# EAGLE design Z05_CC_SHIELD_02 (EAGLE 6.5.0)
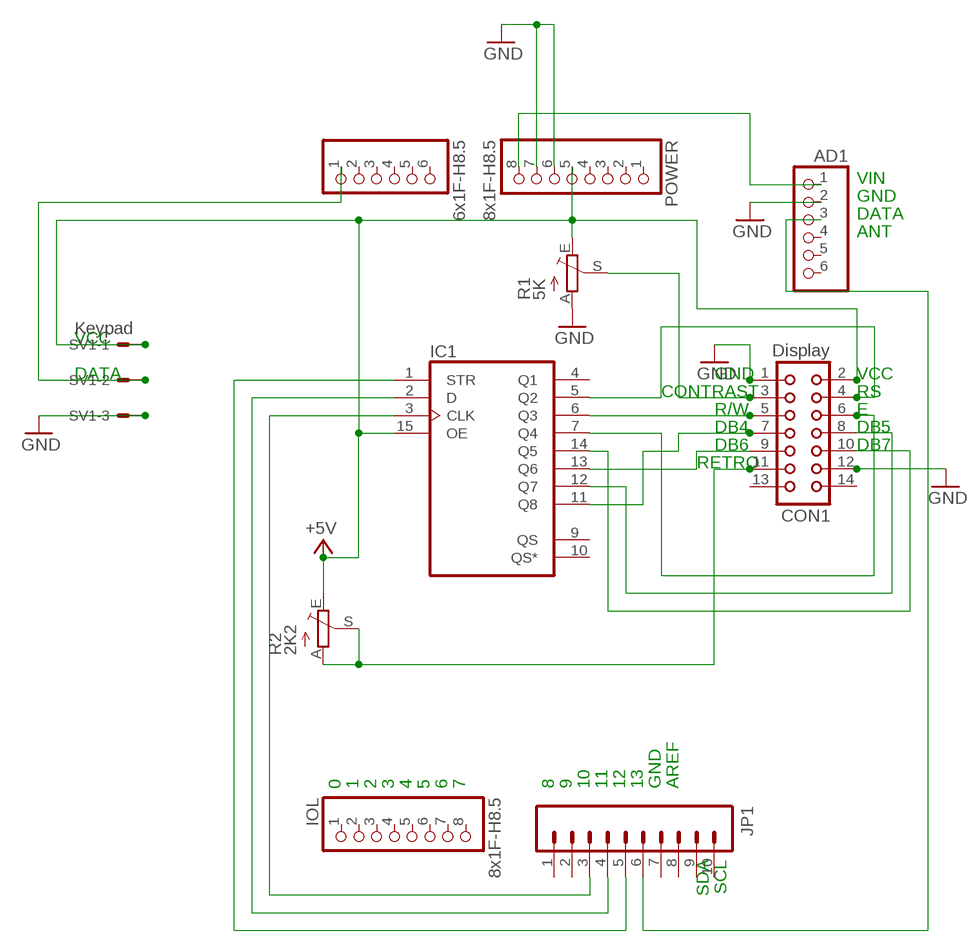
[diagram p0: schematic, sheet 1]

## Parts
AD  6x1F-H8.5  PINHD-1X6  [1X06]
AD1  6x1F-H8.5  PINHD-1X6  [1X06]
CON1  Display  CON14  [CON14]
IC1  4094N  [DIL16]
IOL  8x1F-H8.5  PINHD-1X8  [1X08]
JP1  M10"  [1X10]
POWER  8x1F-H8.5  PINHD-1X8  [1X08]
R1  5K  TRIM_EU-LI10  [LI10]
R2  2K2  TRIM_EU-LI10  [LI10]
SV1  Keypad  22-05-7058-05  [7395-05]

## Nets
+5V [usbvcc]: CON1.2 IC1.15(OE) POWER.5 R1.E R2.E SV1.1
A5: AD.1 SV1.2
GND [gnd]: AD1.2 CON1.1 CON1.12 POWER.6 POWER.7 R1.A SV1.3
N$1: CON1.11 R2.A R2.S
N$3: AD1.3 JP1.6
N$4: CON1.3 R1.S
N$5: IC1.1(STR) JP1.5
N$6: IC1.2(D) JP1.4
N$7: IC1.3(CLK) JP1.3
N$8: CON1.4 IC1.5(Q2)
N$9: CON1.5 IC1.6(Q3)
N$10: CON1.6 IC1.7(Q4)
N$11: CON1.7 IC1.11(Q8)
N$12: CON1.8 IC1.12(Q7)
N$13: CON1.9 IC1.13(Q6)
N$14: CON1.10 IC1.14(Q5)
VIN: AD1.1 POWER.8
Unconnected: AD1.4 AD1.5 AD1.6 AD.2 AD.3 AD.4 AD.5 AD.6 CON1.13 CON1.14 IC1.4(Q1) IC1.9(QS) IC1.10(QS*) IOL.1 IOL.2 IOL.3 IOL.4 IOL.5 IOL.6 IOL.7 IOL.8 JP1.1 JP1.2 JP1.7 JP1.8 JP1.9 JP1.10 POWER.1 POWER.2 POWER.3 POWER.4 SV1.4 SV1.5

## Notes on the sheet
- VIN
- GND
- DATA
- ANT
- VCC
- DATA | GND | VCC
- CONTRAST | RS
- R/W | E
- DB4 | DB5
- DB6 | DB7
- RETRO
- 0 | 1 | 2 | 3 | 4 | 5 | 6 | 7 | 8 | 9 | 10 | 11 | 12 | 13 | GND | AREF
- SDA | SCL

## Power pins joined to a net without a drawn wire
VDD: IC1.16(VDD)
VSS: IC1.8(VSS)

## Library data of the parts
AD AD1 = SmartPrj:PINHD-1X6: PIN HEADER
CON1 = con-harting:CON14: CONNECTOR; OC_FARNELL: unknown; OC_NEWARK: unknown
IC1 = 40xx:4094: 8-stage SHIFT/STORE REGISTER, tri-state
IOL POWER = SmartPrj:PINHD-1X8: PIN HEADER
JP1 = SparkFun-Connectors:M10: Header 10 Standard 10-pin 0.1" header. Use with straight break away headers (SKU : PRT-00116), right angle break away headers (PRT-00553), swiss pins (PRT-00743), machine pins (PRT-00117), and female headers (PRT-00115).
R1 R2 = pot:TRIM_EU-: POTENTIOMETER
SV1 = con-molex:22-?-05: CONNECTOR wire to board 2.54 mm (.1 inch) pitch header; OC_FARNELL: unknown; OC_NEWARK: unknown

## Net classes
0 default: width 0.254 mm, clearance 0.254 mm
1 power: width 0.61 mm, drill 0.61 mm, clearance 0.254 mm
2 gnd: width 0.305 mm, drill 0.559 mm, clearance 0.254 mm
3 usbvcc: width 0.406 mm, drill 0.508 mm, clearance 0.254 mm
4 aref: width 0.406 mm, drill 0.61 mm, clearance 0.254 mm

## Board
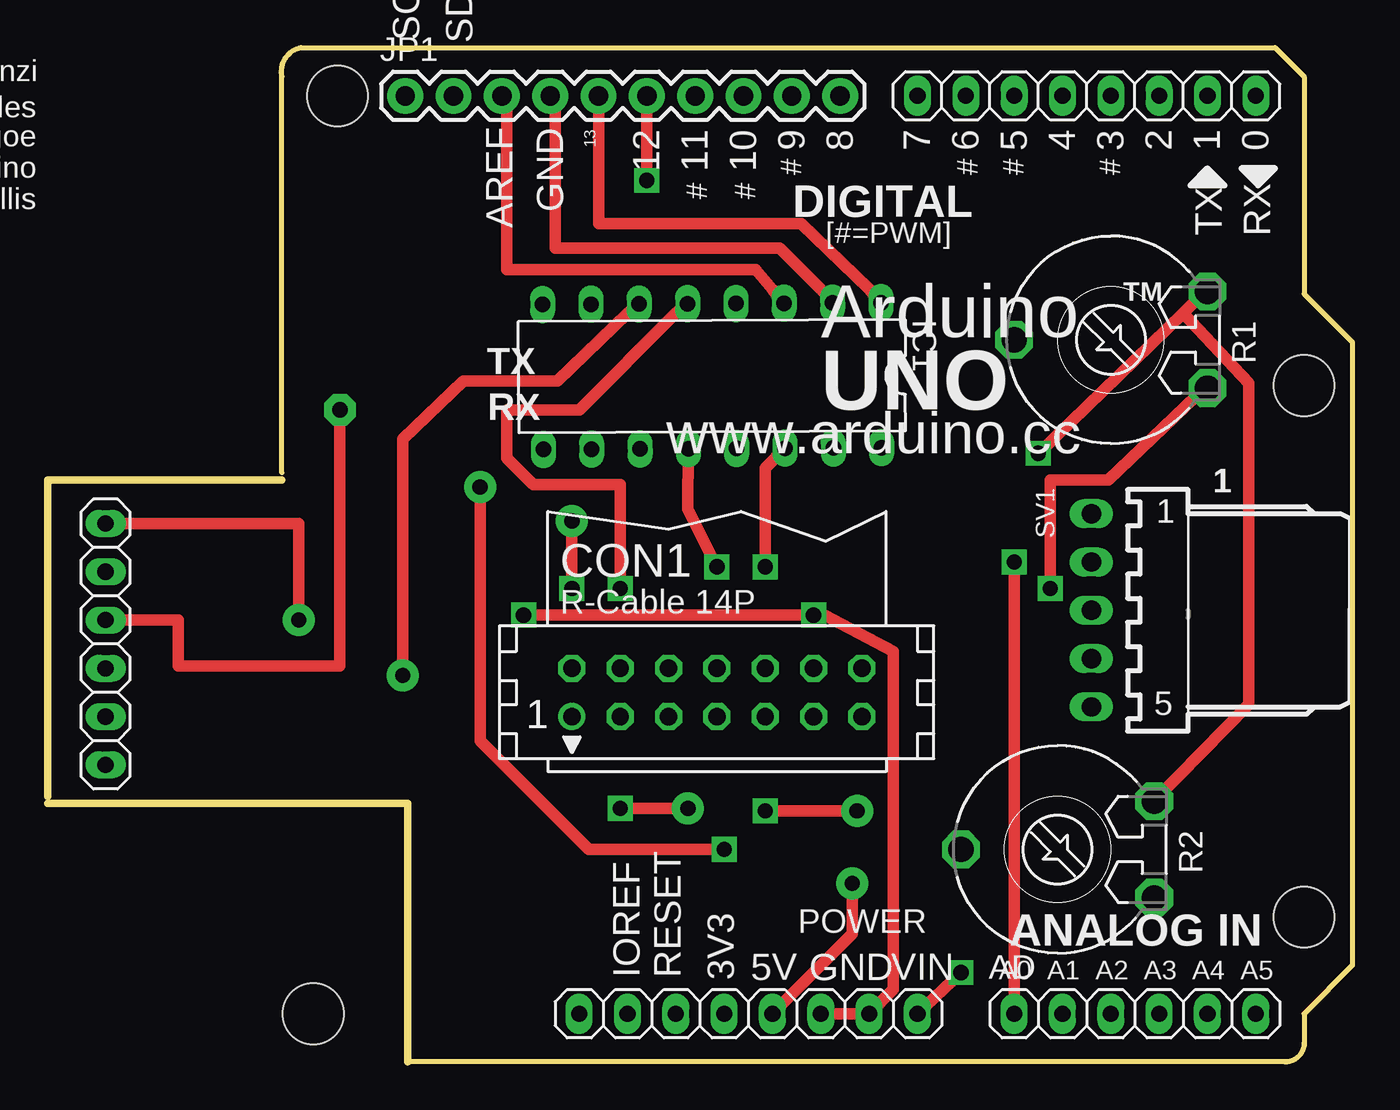
[diagram p1: board, top side]
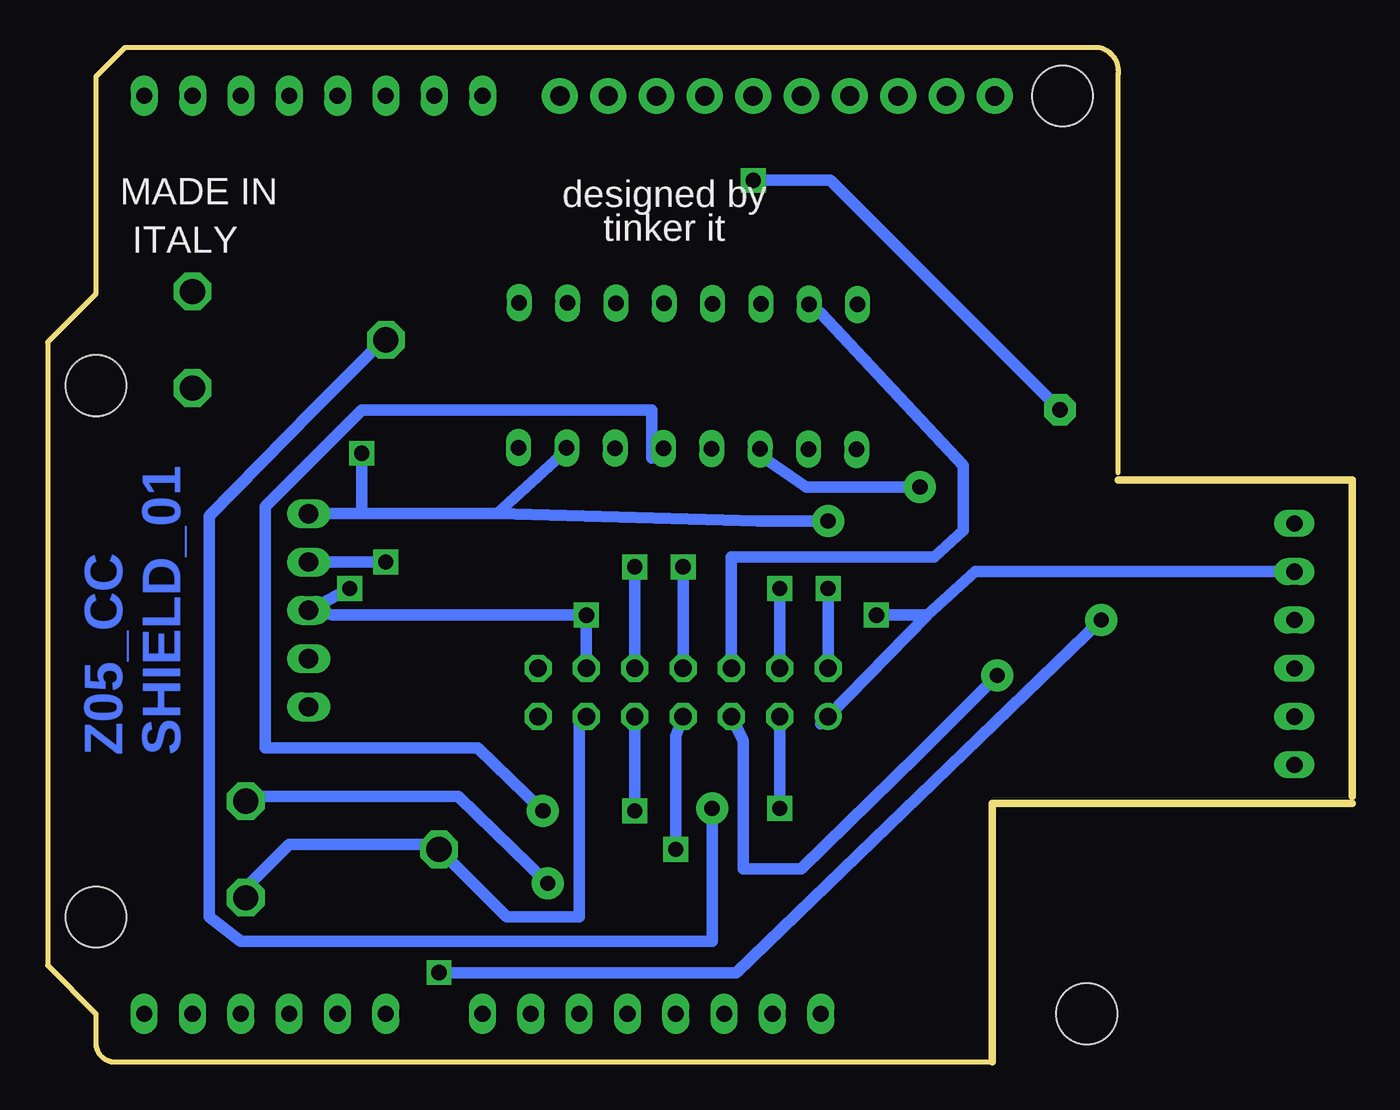
[diagram p2: board, bottom side, seen from below]

Size 68.58 x 53.34 mm. Coordinates in mm from the lower left corner, seen from the top.
Outline: 12.32,30.97 12.32,51.83 arc-90 13.32,53.34 64.52,53.34 66.04,51.82 66.04,40.39 68.58,37.85 68.58,5.08 66.04,2.54 66.04,1 arc-90 65.04,0 18.92,0 18.92,13.59 0,13.59
Outline: 12.32,30.61 0,30.61 0,13.97
Copper layers (1*16): Top 0.035mm / dielectric 1.5mm / Bottom 0.035mm
Design rules "default *": minimum track width 16mil, minimum drill 20mil, track to track 16mil, track to pad 12mil, pad to pad 12mil, via to via 12mil, smd to smd 8mil, copper to edge 26mil, drill to drill 12mil, minimum pad ring 10mil, minimum via ring 10mil, stop-mask expansion 1mil, vias tented up to drill 30mil, thermal gap 10mil
Holes 3.2 mm at 66.04,35.56 66.04,7.62 15.24,50.8 13.97,2.54
vRestrict: area 22.9,44.1 to 24.6,49.1; area 25.4,45.5 to 27.1,49.1; area 28.4,45.3 to 29.6,48.8; area 31,45.3 to 32.1,48.8; area 33.5,45.3 to 34.7,48.8; area 36.1,45.3 to 37.2,48.8; area 38.7,47.2 to 39.9,48.8; area 40.3,45.1 to 47.6,46.9; area 60.3,44.2 to 61.7,46.7; area 62.9,44.2 to 64.3,46.7; area 61.3,35.8 to 64.8,37.2; area 0.6,21.8 to 2,30.1; 14 more areas

### Footprints (pad centres in the part's own frame; a part is rotated, then mirrored left to right if it is on the bottom)
1X06 = drill 0.85 pad 1.422 long: 1 -6.35,0; 2 -3.81,0; 3 -1.27,0; 4 1.27,0; 5 3.81,0; 6 6.35,0
CON14 = drill 0.914: 1 -7.62,-1.27 | drill 0.914 octagon: 2 -7.62,1.27; 3 -5.08,-1.27; 4 -5.08,1.27; 5 -2.54,-1.27; 6 -2.54,1.27; 7 0,-1.27; 8 0,1.27; 9 2.54,-1.27; 10 2.54,1.27; 11 5.08,-1.27; 12 5.08,1.27; 13 7.62,-1.27; 14 7.62,1.27
DIL16 = drill 0.813 long: 1 -8.89,-3.81; 2 -6.35,-3.81; 3 -3.81,-3.81; 4 -1.27,-3.81; 5 1.27,-3.81; 6 3.81,-3.81; 7 6.35,-3.81; 8 8.89,-3.81; 9 8.89,3.81; 10 6.35,3.81; 11 3.81,3.81; 12 1.27,3.81; 13 -1.27,3.81; 14 -3.81,3.81; 15 -6.35,3.81; 16 -8.89,3.81
1X08 = drill 0.85 pad 1.422 long: 1 -8.89,0; 2 -6.35,0; 3 -3.81,0; 4 -1.27,0; 5 1.27,0; 6 3.81,0; 7 6.35,0; 8 8.89,0
1X10 = drill 1.016 pad 1.88: 1 0,0; 2 2.54,0; 3 5.08,0; 4 7.62,0; 5 10.16,0; 6 12.7,0; 7 15.24,0; 8 17.78,0; 9 20.32,0; 10 22.86,0
LI10 = drill 1.321 octagon: A -2.54,-5.08; E 2.54,-5.08; S 0,5.08
7395-05 = drill 1.016 long: 1 5.08,0; 2 2.54,0; 3 0,0; 4 -2.54,0; 5 -5.08,0

### Placement (x,y rotation side)
AD  57.15,2.54 0 top
AD1  3.05,21.97 270 top
CON1  35.18,19.43 0 top
IC1  34.92,36.07 180.3 top
IOL  54.61,50.8 180 top
JP1  18.8,50.8 0 top
POWER  36.83,2.54 0 top
R1  55.88,37.97 90 top
R2  53.09,11.18 90 top
SV1  54.86,23.75 90 top

### Tracks (layer width: path | path; a pad name or v marks a point on that pad's centre or on a via)
+5V  (via drill 0.8, 0.8 pad 1.68)
  Top 0.61: POWER.5 42.29,6.73 v42.29,9.4 | v27.56,28.45 v27.56,24.89 | v52.07,32 59.69,39.37 | 59.69,39.37 60.96,40.64 R1.E | R2.E 63.12,18.8 63.12,35.69 59.69,39.37
  Bottom 0.508: 58.42,13.97 R2.E
  Bottom 0.61: v42.29,9.4 46.99,13.97 58.42,13.97 | 44.96,28.83 41.91,31.62 IC1.15 | 44.96,28.83 52.07,28.83 | 52.07,28.83 SV1.1 | v27.56,24.89 CON1.2 | v27.56,28.45 31.24,28.45 44.96,28.83 | 52.07,28.83 v52.07,32
A5  (via drill 0.8)
  Top 0.61: v50.8,26.29 AD.1
  Bottom 0.61: SV1.2 v50.8,26.29
GND  (via drill 0.8)
  Top 0.406: 60.96,35.56 R1.A
  Top 0.61: POWER.6 POWER.7 44.45,3.81 44.45,21.59 40.39,23.75 v40.26,23.5 v25.02,23.5 | 60.96,35.56 55.75,30.61 52.7,30.61 v52.7,24.89
  Bottom 0.61: AD1.2 19.81,25.78 22.35,23.5 | 22.35,23.5 CON1.1 27.94,17.78 | CON1.12 v40.26,23.5 53.59,23.5 SV1.3 v52.7,24.89 | v25.02,23.5 22.35,23.5
N$1
  Bottom 0.406: 48.26,11.43 R2.S
  Bottom 0.61: R2.S 44.45,7.62 40.64,7.62 40.64,17.78 CON1.11 | 48.26,11.43 55.88,11.43 58.42,8.89 R2.A
N$3  (via drill 0.8, 0.8 pad 1.68)
  Top 0.61: AD1.3 6.86,23.24 6.86,20.83 15.37,20.83 v15.37,34.29 | v31.5,46.35 JP1.6
  Bottom 0.61: v31.5,46.35 27.43,46.35 v15.37,34.29
N$4  (via drill 0.8, 0.8 pad 1.68)
  Top 0.61: v33.66,13.34 v30.1,13.34
  Bottom 0.61: v30.1,13.34 CON1.3 | v33.66,13.34 33.66,6.35 58.42,6.35 60.07,7.62 60.07,28.7 54.61,34.29 50.8,38.1 R1.S
N$5
  Top 0.61: IC1.1 43.69,40.01 43.18,40.64 39.62,44.07 28.96,44.07 JP1.5
N$6
  Top 0.406: 41.27,39.88 IC1.2
  Top 0.61: 41.27,39.88 40.64,40.64 38.48,42.8 26.67,42.8 26.67,50.8 JP1.4
N$7
  Top 0.61: IC1.3 38.48,40.13 38.1,40.64 37.21,41.66 24.13,41.66 24.13,50.8 JP1.3
N$8  (via drill 0.8)
  Top 0.61: v30.1,24.89 30.1,30.35 25.53,30.35 24.13,31.75 24.13,34.29 27.94,34.29 33.02,39.37 IC1.5
  Bottom 0.61: CON1.4 v30.1,24.89
N$9  (via drill 0.8 pad 1.68)
  Top 0.61: v18.67,20.32 18.67,32.77 21.84,35.81 26.8,35.81 30.48,39.37 IC1.6
  Bottom 0.61: v18.67,20.32 22.86,16.13 28.96,10.16 32,10.16 32,16.89 CON1.5
N$10
  Bottom 0.61: CON1.6 32.64,26.54 21.97,26.54 20.45,27.94 20.45,31.37 27.94,39.37 IC1.7
N$11  (via drill 0.8, 0.8 pad 1.68)
  Top 0.61: v22.73,30.23 22.73,16.89 28.45,11.18 v35.56,11.18
  Bottom 0.61: v22.73,30.23 28.7,30.23 30.73,31.62 IC1.11 | CON1.7 35.56,17.14 v35.56,11.18
N$12  (via drill 0.8)
  Top 0.61: v35.18,26.04 33.66,29.08 IC1.12
  Bottom 0.61: CON1.8 v35.18,26.04
N$13  (via drill 0.8, 0.8 pad 1.68)
  Top 0.61: v37.72,13.21 v42.55,13.21
  Bottom 0.61: v42.55,13.21 45.97,16.51 57.15,16.51 57.15,29.21 52.07,34.29 36.83,34.29 36.83,31.75 IC1.13 | v37.72,13.21 CON1.9
N$14  (via drill 0.8)
  Top 0.61: v37.72,26.04 37.72,31.24 IC1.14
  Bottom 0.61: CON1.10 v37.72,26.04
VIN  (via drill 0.8, 0.8 pad 1.68)
  Top 0.61: AD1.1 13.21,28.32 v13.21,23.24 | POWER.8 v48.01,4.7
  Bottom 0.61: v13.21,23.24 32.38,4.7 v48.01,4.7

### Text on the board
Bottom: Z05_CC / SHIELD_01
tPlace: 13 | 12 | 11 | 10 | 9 | 8 | 7 | 6 | 5 | 4 | 3 | 2 | 1 | 0
tNames: SCL | SDA | M.Banzi | D.Cuartielles | T.Igoe | AREF | GND | G.Martino | # | # | # | # | D.Mellis | # | # | DIGITAL | [#=PWM] | TX | RX | TM | TX | Arduino | RX | UNO | www.arduino.cc | 1 | ANALOG IN | IOREF | RESET | 3V3 | 5V | GND | VIN | A0 | A1 | A2 | A3 | A4 | A5
bNames: MADE IN | designed by | MADE IN | ITALY | tinker it | ITALY | designed by | tinker it | ATMEGA328
ReferenceLC: L | TX | ON | RX | PC1 | PC2
214bmp: D:/SmartProjects/Snc/a4_bn_logo2.bmp